# EAGLE schematic Safmet (EAGLE 9.6.2)

## Sheet 1 of 2
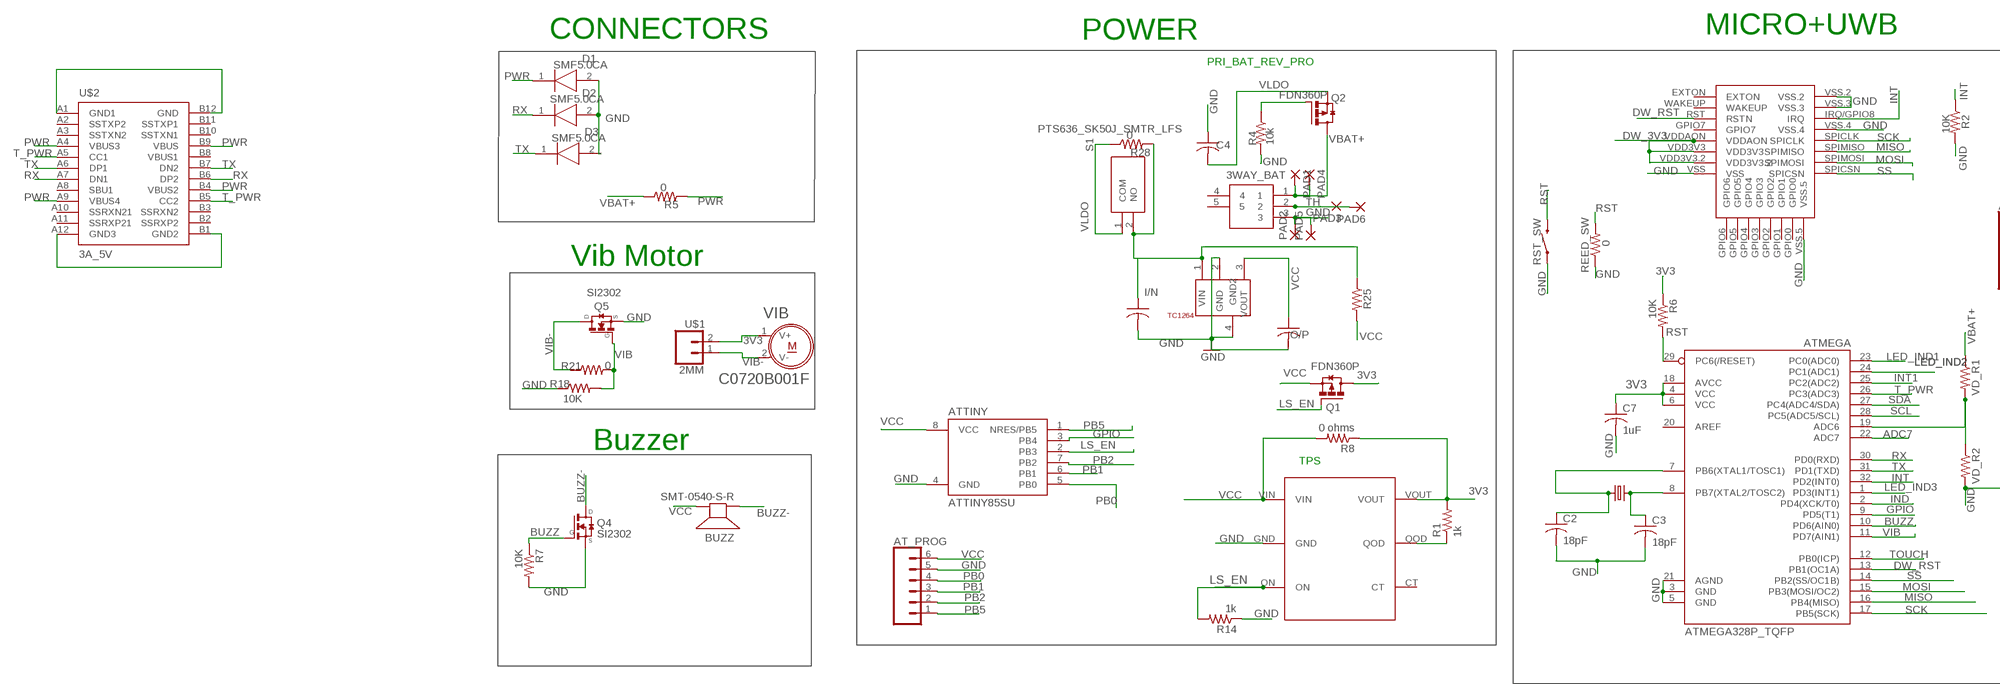
[diagram p0: schematic, sheet 1, part 1 of 2]
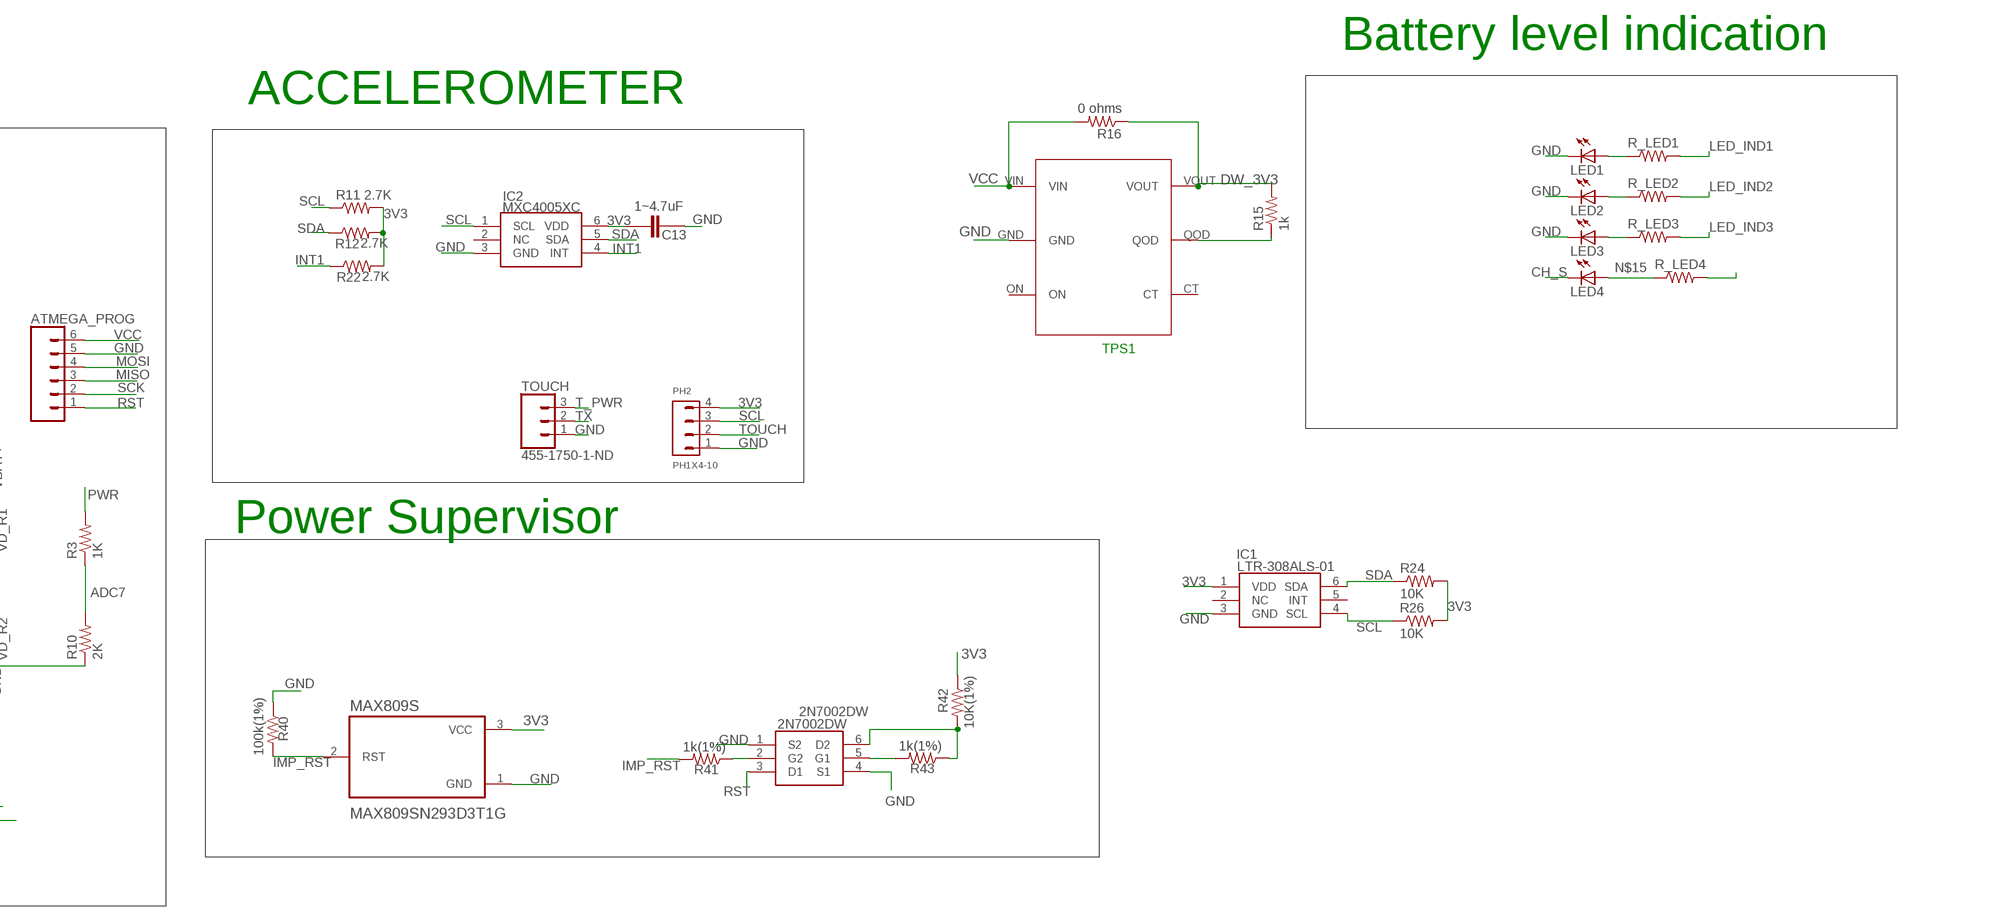
[diagram p1: schematic, sheet 1, part 2 of 2]

### Parts
2N7002DW  2N7002DW  [SOT65P210X110-6N]
3WAY_BAT  009155003541006  [009155003541006]
16MHZ  16MHz  CRYSTALTXC-7A  [CRYSTAL-TXC-7A]
AT_PROG  CONN_061.27MM  [1X06_1.27MM]
ATMEGA  ATMEGA328P_TQFP  [TQFP32-08]
ATMEGA_PROG  CONN_061.27MM  [1X06_1.27MM]
ATTINY  ATTINY85SU  [ATTINY85]
BUZZ  SMT-0540-S-R  [SMT-0540-S-R]
C2  18pF  C-US_CHIP-0402(1005-METRIC)  [CAPC1005X60]
C3  18pF  C-US_CHIP-0402(1005-METRIC)  [CAPC1005X60]
C4  4.7uF  C-US_CHIP-0402(1005-METRIC)  [CAPC1005X60]
C7  1uF  C-US_CHIP-0402(1005-METRIC)  [CAPC1005X60]
C13  1~4.7uF  C0402C201GAGACTU  [CAPC1005X55N]
D1  SMF5.0CA  [SODFL3618X108N]
D2  SMF5.0CA  [SODFL3618X108N]
D3  SMF5.0CA  [SODFL3618X108N]
DECAWAVE  DWM1000  [DWM1000]
I/N  1uF  C-US_CHIP-0402(1005-METRIC)  [CAPC1005X60]
IC1  LTR-308ALS-01  [LTR303ALS01]
IC2  MXC4005XC  [MXC4005XC]
LDO  TC1264  [SOT223]
LED1  LEDCHIPLED_0603  [CHIPLED_0603]
LED2  LEDCHIPLED_0603  [CHIPLED_0603]
LED3  LEDCHIPLED_0603  [CHIPLED_0603]
LED4  LEDCHIPLED_0603  [CHIPLED_0603]
MAX809S  MAX809SN293D3T1G  [SOT95P237X111-3N]
O/P  1uF 10V  C-US_CHIP-0402(1005-METRIC)  [CAPC1005X60]
PAD1  SMD2  [SMD1,27-2,54]
PAD2  SMD2  [SMD1,27-2,54]
PAD3  SMD2  [SMD1,27-2,54]
PAD4  SMD2  [SMD1,27-2,54]
PAD5  SMD2  [SMD1,27-2,54]
PAD6  SMD2  [SMD1,27-2,54]
PH2  PH1X4-10  [PH010-1-4]
Q1  FDN360P  [SUPER-SOT3]
Q2  FDN360P  [SUPER-SOT3]
Q4  SI2302  [SOT23]
Q5  SI2302  [SOT23]
R1  1k  R-US_R0402  [R0402]
R2  10K  R-US_R0402  [R0402]
R3  1K  R-US_R0402  [R0402]
R4  10k  R-US_R0402  [R0402]
R5  0  R-US_R0402  [R0402]
R6  10K  R-US_R0402  [R0402]
R7  10K  R-US_R0402  [R0402]
R8  0 ohms  R-US_R0402  [R0402]
R10  2K  R-US_R0402  [R0402]
R11  2.7K  R-US_R0402  [R0402]
R12  2.7K  R-US_R0402  [R0402]
R14  1k  R-US_R0402  [R0402]
R15  1k  R-US_R0402  [R0402]
R16  0 ohms  R-US_R0402  [R0402]
R18  10K  R-US_R0402  [R0402]
R21  0  R-US_R0402  [R0402]
R22  2.7K  R-US_R0402  [R0402]
R24  10K  R-US_R0402  [R0402]
R25  0ohm  R-US_R0402  [R0402]
R26  10K  R-US_R0402  [R0402]
R28  0  R-US_R0402  [R0402]
R40  100k(1%)  R-US_R0402  [R0402]
R41  1k(1%)  R-US_R0402  [R0402]
R42  10K(1%)  R-US_R0402  [R0402]
R43  1k(1%)  R-US_R0402  [R0402]
R_LED1  220  R-US_R0402  [R0402]
R_LED2  220  R-US_R0402  [R0402]
R_LED3  220  R-US_R0402  [R0402]
R_LED4  220  R-US_R0402  [R0402]
REED_SW  0  0_OHM_AXIAL-0.3_1/4W_5%  [AXIAL-0.3]
RST_SW  MOMENTARY-SWITCH-SPST-SMD-6.0X3.5MM  [TACTILE_SWITCH_SMD_6.0X3.5MM]
S1  PTS636_SK50J_SMTR_LFS  [PTS636SK50JSMTRLFS]
TOUCH  455-1750-1-ND  HACK_CONN_03  [1X03]
TPS  TPS22918  [SOT-23-6]
TPS1  TPS22918  [SOT-23-6]
U$1  2MM  [PHLS005-1-2]
U$2  3A_5V  USB-31C-F-24X7F  [CUI_USB-31C-F-24X7F]
VD_R1  12K  R-US_R0402  [R0402]
VD_R2  3.9K  R-US_R0402  [R0402]
VIB  C0720B001F  [XDCR_C0720B001F]

### Nets
3V3: ATMEGA.4(VCC) ATMEGA.6(VCC) ATMEGA.18(AVCC) C7.1 C13.1 IC1.1(VDD) IC2.6(VDD) MAX809S.3(VCC) PH2.4 Q1.3(D) R1.2 R6.1 R8.1 R11.2 R12.2 R22.2 R24.2 R26.2 R42.1 TPS.VOUT U$1.2 VIB.1(V+)
ADC7: ATMEGA.22(ADC7) R3.1 R10.2
BUZZ: ATMEGA.10(PD6(AIN0)) Q4.1(G) R7.1
BUZZ-: BUZZ.-(+) Q4.3(D)
CH_S: LED4.C ; also sheet 2
DW_3V3: DECAWAVE.VDD3V3 DECAWAVE.VDD3V3.2 DECAWAVE.VDDAON R15.2 R16.1 TPS1.VOUT
DW_RST: ATMEGA.13(PB1(OC1A)) DECAWAVE.RST(RSTN)
GND: 2N7002DW.1(S2) 2N7002DW.4(S1) 3WAY_BAT.3 AT_PROG.5 ATMEGA.3(GND) ATMEGA.5(GND) ATMEGA.21(AGND) ATMEGA_PROG.5 ATTINY.4(GND) C2.2 C3.2 C4.1 C7.2 C13.2 D1.2(A) D2.2(A) D3.2(A) DECAWAVE.VSS DECAWAVE.VSS.2 DECAWAVE.VSS.3 DECAWAVE.VSS.4 DECAWAVE.VSS.5 I/N.2 IC1.3(GND) IC2.3(GND) LDO.2(GND) LDO.4(GND2) LED1.C LED2.C LED3.C MAX809S.1(GND) O/P.2 PAD2.1(P) PAD5.1(P) PH2.1 Q4.2(S) Q5.2(S) R2.2 R4.2 R7.2 R10.1 R14.1 R18.1 R40.1 REED_SW.P$1 RST_SW.1 TOUCH.1 TPS1.GND TPS.GND VD_R2.2 ; also sheet 2
GPIO: ATMEGA.9(PD5(T1)) ATTINY.3(PB4)
IMP_RST: MAX809S.2(RST) R40.2 R41.2
IND: ATMEGA.2(PD4(XCK/T0)) ; also sheet 2
INT: ATMEGA.32(PD2(INT0)) DECAWAVE.IRQ/GPIO8(IRQ) R2.1
INT1: ATMEGA.25(PC2(ADC2)) IC2.4(INT) R22.1
LED_IND1: ATMEGA.23(PC0(ADC0)) R_LED1.2
LED_IND2: ATMEGA.24(PC1(ADC1)) R_LED2.2
LED_IND3: ATMEGA.1(PD3(INT1)) R_LED3.2
LS_EN: ATTINY.2(PB3) Q1.1(G) R14.2 TPS.ON
MISO: ATMEGA.16(PB4(MISO)) ATMEGA_PROG.3 DECAWAVE.SPIMISO
MOSI: ATMEGA.15(PB3(MOSI/OC2)) ATMEGA_PROG.4 DECAWAVE.SPIMOSI
N$1: R_LED4.2
N$2: 16MHZ.P$2 ATMEGA.8(PB7(XTAL2/TOSC2)) C3.1
N$3: 16MHZ.P$1 ATMEGA.7(PB6(XTAL1/TOSC1)) C2.1
N$4: 2N7002DW.2(G2) R41.1
N$5: R1.1 TPS.QOD
N$6: Q2.1(G) R4.1
N$7: LED1.A R_LED1.1
N$8: LED2.A R_LED2.1
N$9: I/N.1 LDO.1(VIN) R25.1 R28.2 S1.2(NO)
N$12: ATMEGA.19(ADC6) VD_R1.2 VD_R2.1
N$15: LED4.A R_LED4.1 ; also sheet 2
N$16: R15.1 TPS1.QOD
N$17: LED3.A R_LED3.1
N$18: U$2.A1(GND1) U$2.B12(GND)
N$19: U$2.A12(GND3) U$2.B1(GND2)
N$23: 2N7002DW.6(D2) R42.2 R43.1
N$24: 2N7002DW.5(G1) R43.2
PB0: AT_PROG.4 ATTINY.5(PB0)
PB1: AT_PROG.3 ATTINY.6(PB1)
PB2: AT_PROG.2 ATTINY.7(PB2)
PB5: AT_PROG.1 ATTINY.1(NRES/PB5)
PWR: D1.1(K) R3.2 R5.2 U$2.A4(VBUS3) U$2.A9(VBUS4) U$2.B4(VBUS2) U$2.B9(VBUS) ; also sheet 2
RST: 2N7002DW.3(D1) ATMEGA.29(PC6(/RESET)) ATMEGA_PROG.1 R6.2 REED_SW.P$2 RST_SW.2
RX: ATMEGA.30(PD0(RXD)) D2.1(K) U$2.A7(DN1) U$2.B6(DP2)
SCK: ATMEGA.17(PB5(SCK)) ATMEGA_PROG.2 DECAWAVE.SPICLK
SCL: ATMEGA.28(PC5(ADC5/SCL)) IC1.4(SCL) IC2.1(SCL) PH2.3 R11.1 R26.1
SDA: ATMEGA.27(PC4(ADC4/SDA)) IC1.6(SDA) IC2.5(SDA) R12.1 R24.1
SS: ATMEGA.14(PB2(SS/OC1B)) DECAWAVE.SPICSN
T_PWR: ATMEGA.26(PC3(ADC3)) TOUCH.3 U$2.A5(CC1) U$2.B5(CC2)
TH: 3WAY_BAT.2 PAD3.1(P) PAD6.1(P) ; also sheet 2
TOUCH: ATMEGA.12(PB0(ICP)) PH2.2
TX: ATMEGA.31(PD1(TXD)) D3.1(K) TOUCH.2 U$2.A6(DP1) U$2.B7(DN2)
VBAT+: 3WAY_BAT.1 PAD1.1(P) PAD4.1(P) Q2.3(D) R5.1 VD_R1.1 ; also sheet 2
VCC: AT_PROG.6 ATMEGA_PROG.6 ATTINY.8(VCC) BUZZ.+(-) LDO.3(VOUT) O/P.1 Q1.2(S) R8.2 R16.2 R25.2 TPS1.VIN TPS.VIN
VIB: ATMEGA.11(PD7(AIN1)) Q5.1(G) R18.2 R21.2
VIB-: Q5.3(D) R21.1 U$1.1 VIB.2(V-)
VLDO: C4.2 Q2.2(S) R28.1 S1.1(COM)
Unconnected: 3WAY_BAT.4 3WAY_BAT.5 ATMEGA.20(AREF) DECAWAVE.EXTON DECAWAVE.GPIO0 DECAWAVE.GPIO1 DECAWAVE.GPIO2 DECAWAVE.GPIO3 DECAWAVE.GPIO4 DECAWAVE.GPIO5 DECAWAVE.GPIO6 DECAWAVE.GPIO7 DECAWAVE.WAKEUP IC1.2(NC) IC1.5(INT) IC2.2(NC) TPS1.CT TPS1.ON TPS.CT U$2.A2(SSTXP2) U$2.A3(SSTXN2) U$2.A8(SBU1) U$2.A10(SSRXN21) U$2.A11(SSRXP21) U$2.B2(SSRXP2) U$2.B3(SSRXN2) U$2.B8(VBUS1) U$2.B10(SSTXN1) U$2.B11(SSTXP1)

### Notes on the sheet
- Battery level indication
- CONNECTORS | MICRO+UWB | ACCELEROMETER
- POWER
- PRI_BAT_REV_PRO
- TPS1
- Vib Motor
- Power Supervisor
- Buzzer
- TPS

## Sheet 2 of 2
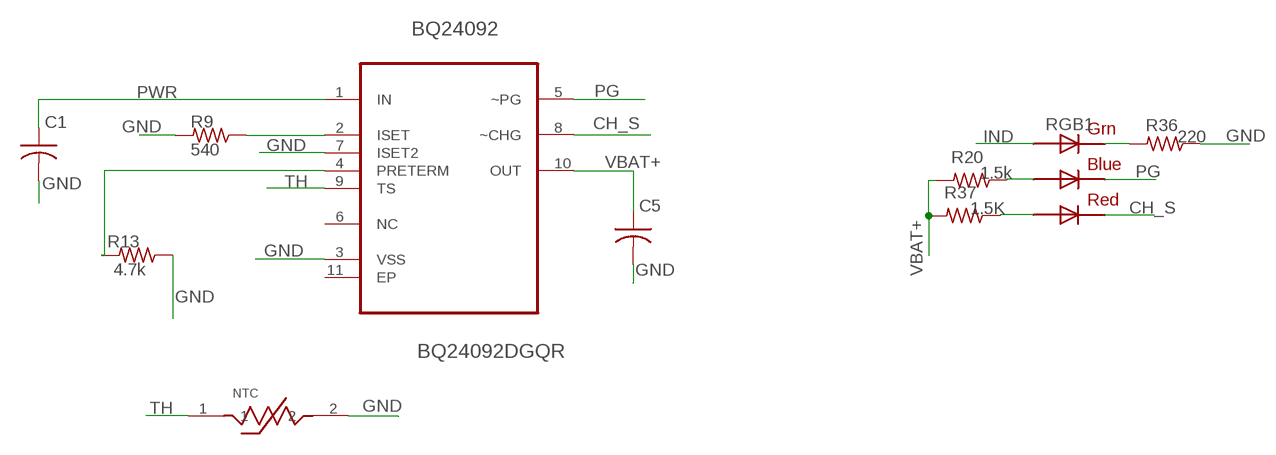
[diagram p2: schematic, sheet 2]

### Parts
BQ24092  BQ24092DGQR  [SOP50P490X110-11N]
C1  1uF  C-US_CHIP-0402(1005-METRIC)  [CAPC1005X60]
C5  1uF  C-US_CHIP-0402(1005-METRIC)  [CAPC1005X60]
NTC  NCP18WF104J03RB  [THERM_NCP18WF104J03RB]
R9  540  R-US_R0402  [R0402]
R13  4.7k  R-US_R0402  [R0402]
R20  1.5k  R-US_R0402  [R0402]
R36  220  R-US_R0402  [R0402]
R37  1.5K  R-US_R0402  [R0402]
RGB1  RGBLED5050  [RGBLED5050]

### Nets
CH_S: BQ24092.8(~CHG) RGB1.5(RED_C) ; also sheet 1
GND: BQ24092.3(VSS) BQ24092.7(ISET2) C1.2 C5.2 NTC.2 R9.2 R13.1 R36.1 ; also sheet 1
IND: RGB1.3(BLUE_A) ; also sheet 1
N$10: BQ24092.2(ISET) R9.1
N$11: BQ24092.4(PRETERM) R13.2
N$13: R36.2 RGB1.4(BLUE_C)
N$14: R20.1 RGB1.1(GREEN_A)
N$15: R37.1 RGB1.2(RED_A) ; also sheet 1
PG: BQ24092.5(~PG) RGB1.6(GREEN_C)
PWR: BQ24092.1(IN) C1.1 ; also sheet 1
TH: BQ24092.9(TS) NTC.1 ; also sheet 1
VBAT+: BQ24092.10(OUT) C5.1 R20.2 R37.2 ; also sheet 1
Unconnected: BQ24092.6(NC) BQ24092.11(EP)

## Library data of the parts
2N7002DW = 2N7002DW:2N7002DW: 2N7002DW, Dual N-channel MOSFET Transistor, 0.115A 60V, 6-Pin SC-70 Source: Datasheet; DESCRIPTION: 2N7002DW, Dual N-channel MOSFET Transistor, 0.115A 60V, 6-Pin SC-70; HEIGHT: 1.1mm; MANUFACTURER_NAME: ON Semiconductor; MANUFACTURER_PART_NUMBER: 2N7002DW; MOUSER_PART_NUMBER: 512-2N7002DW; MOUSER_PRICE-STOCK: https://www.mouser.co.uk/ProductDetail/ON-Semiconductor/2N7002DW?qs=4aVxpR%2FL9VItb3yGt5CeZg%3D%3D
3WAY_BAT = 009155003541006:009155003541006: Battery Contacts 3 Way .4um Gold RT Angle 2.5mm Source: Datasheet <https://componentsearchengine.com/Datasheets/1/009155003541006.pdf>; DESCRIPTION: Battery Contacts 3 Way .4um Gold RT Angle 2.5mm; HEIGHT: 4mm; MANUFACTURER_NAME: AVX; MANUFACTURER_PART_NUMBER: 009155003541006; MOUSER_PART_NUMBER: 581-009155003541006; MOUSER_PRICE-STOCK: https://www.mouser.com/Search/Refine.aspx?Keyword=581-009155003541006
16MHZ = SparkFun-FreqCtrl:CRYSTAL: Various standard crystals. Proven footprints.
AT_PROG ATMEGA_PROG = SparkFun-Connectors:CONN_06: Multi connection point. Often used as Generic Header-pin footprint for 0.1 inch spaced/style header connections On any of the 0.1 inch spaced packages, you can populate with these: Break Away Headers - Straight <https://www.sparkfun.com/products/116> (PRT-00116) Break Away Male Headers - Right Angle <https://www.sparkfun.com/products/553> (PRT-00553) Female Headers <https://www.sparkfun.com/products/115> (PRT-00115) Break Away Headers - Machine Pin <https://www.sparkfun.com/products/117> (PRT-00117) Break Away Female Headers - Swiss Machine Pin <https://www.sparkfun.com/products/743> (PRT-00743) Arduino Stackable Header - 6 Pin <https://www.sparkfun.com/products/9280> (PRT-09280) For SCREWTERMINALS and SPRING TERMINALS visit here: Screw Terimnals on SparkFun.com <https://www.sparkfun.com/search/results?term=Screw+Terminals> (5mm/3.5mm/2.54mm spacing) This device is also useful as a general connection point to wire up your design to another part of your project. Our various solder wires solder well into these plated through hole pads. Hook-Up Wire - Assortment (Stranded, 22 AWG) <https://www.sparkfun.com/products/11375> (PRT-11375) Hook-Up Wire - Assortment (Solid Core, 22 AWG) <https://www.sparkfun.com/products/11367> (PRT-11367) View the entire wire category on our website here <https://www.sparkfun.com/categories/141>
ATMEGA = SparkFun-DigitalIC:ATMEGA328P_TQFP; PROD_ID: IC-09069
ATTINY = attiny85:ATTINY85: ATMEL ATtiny 85
BQ24092 = BQ24092DGQR:BQ24092DGQR: 1A, Single-Input, Single Cell Li-Ion Battery Charger; AVAILABILITY: Unavailable; DESCRIPTION: 1A, Single-Input, Single-Cell Li-Ion Battery Charger with Operation Over JEITA and 10kO NTC 10-MSOP-PowerPAD -40 to 150; MF: Texas Instruments; MP: BQ24092DGQR; PACKAGE: MSOP-10 Texas Instruments; PRICE: None
BUZZ = adafruit:SMT-0540-S-R: SMT-0549-S-R Small surface-mount magnetic buzzer
C1-C5 C7 I/N O/P = Capacitor:C-US: Capacitor - ANSI; CATEGORY: Capacitor
C13 = C0402C201GAGACTU:C0402C201GAGACTU; AVAILABILITY: Unavailable; DESCRIPTION: Multilayer Ceramic Capacitors MLCC - SMD/SMT 250V 200pF C0G 0402 0.02; MF: KEMET; MP: C0402C201GAGACTU; PACKAGE: 0402 KEMET; PRICE: None
D1-D3 = SMF5.0CA:SMF5.0CA: ESD Suppressors / TVS Diodes "TVS SMF 5.0V BI, 7'' TR" Surface Mount 200W > SMF Series Source: Datasheet <https://www.mouser.de/datasheet/2/240/Littelfuse_TVS_Diode_SMF_Datasheet.pdf-1698977.pdf>; DESCRIPTION: ESD Suppressors / TVS Diodes "TVS SMF 5.0V BI, 7'' TR" Surface Mount 200W > SMF Series; HEIGHT: 1.08mm; MANUFACTURER_NAME: LITTELFUSE; MANUFACTURER_PART_NUMBER: SMF5.0CA; MOUSER_PART_NUMBER: 576-SMF5.0CA; MOUSER_PRICE-STOCK: https://www.mouser.co.uk/ProductDetail/Littelfuse/SMF50CA?qs=d0WKAl%252BL4KbRT8gYdmqI%252Bg%3D%3D
DECAWAVE = DWM1000:DWM1000
IC1 = LTR-308ALS-01:LTR-308ALS-01: Ambient Light Sensors Ambient Light Photo Sensor Source: Datasheet <https://optoelectronics.liteon.com/upload/download/DS86-2016-0027/LTR-308ALS_Final_ DS_V1 1.pdf>; DESCRIPTION: Ambient Light Sensors Ambient Light Photo Sensor; HEIGHT: 0mm; MANUFACTURER_NAME: Lite-On; MANUFACTURER_PART_NUMBER: LTR-308ALS-01; MOUSER_PART_NUMBER: N/A; MOUSER_PRICE-STOCK: https://www.mouser.com/Search/Refine.aspx?Keyword=N%2FA
IC2 = MXC4005XC_ACC:MXC4005XC: Accelerometers Monolithic and Wafer Level Packaged Three-Axis Accelerometer Source: Datasheet <http://www.memsic.cn/userfiles/files/Datasheets/Accelerometer-Datasheets/MXC400xXC_Rev_B.pdf>; DESCRIPTION: Accelerometers Monolithic and Wafer Level Packaged Three-Axis Accelerometer; HEIGHT: 0.885mm; MANUFACTURER_NAME: MEMSIC; MANUFACTURER_PART_NUMBER: MXC4005XC; MOUSER_PART_NUMBER: 438-MXC4005XC; MOUSER_PRICE-STOCK: https://www.mouser.co.uk/ProductDetail/MEMSIC/MXC4005XC?qs=RcG8xmE7yp3iyYgWLmAtUw%3D%3D
LDO = tc1264:TC1264
LED1-LED4 = adafruit:LED: LED OSRAM: - CHIPLED LG R971, LG N971, LY N971, LG Q971, LY Q971, LO R971, LY R971 LH N974, LH R974 LS Q976, LO Q976, LY Q976 LO Q996 - Hyper CHIPLED LW Q18S LB Q993, LB Q99A, LB R99A - SideLED LS A670, LO A670, LY A670, LG A670, LP A670 LB A673, LV A673, LT A673, LW A673 LH A674 LY A675 LS A676, LA A676, LO A676, LY A676, LW A676 LS A679, LY A679, LG A679 - Hyper Micro SIDELED® LS Y876, LA Y876, LO Y876, LY Y876 LT Y87S - SmartLED LW L88C, LW L88S LB L89C, LB L89S, LG L890 LS L89K, LO L89K, LY L89K LS L896, LA L896, LO L896, LY L896 - TOPLED LS T670, LO T670, LY T670, LG T670, LP T670 LSG T670, LSP T670, LSY T670, LOP T670, LYG T670 LG T671, LOG T671, LSG T671 LB T673, LV T673, LT T673, LW T673 LH T674 LS T676, LA T676, LO T676, LY T676, LB T676, LH T676, LSB T676, LW T676 LB T67C, LV T67C, LT T67C, LS T67K, LO T67K, LY T67K, LW E67C LS E67B, LA E67B, LO E67B, LY E67B, LB E67C, LV E67C, LT E67C LW T67C LS T679, LY T679, LG T679 LS T770, LO T770, LY T770, LG T770, LP T770 LB T773, LV T773, LT T773, LW T773 LH T774 LS E675, LA E675, LY E675, LS T675 LS T776, LA T776, LO T776, LY T776, LB T776 LHGB T686 LT T68C, LB T68C - Hyper Mini TOPLED® LB M676 - Mini TOPLED Santana® LG M470 LS M47K, LO M47K, LY M47K Source: http://www.osram.convergy.de/
MAX809S = MAX809SN293D3T1G:MAX809SN293D3T1G: None Check prices <https://pricing.snapeda.com/search/part/MAX809SN293D3T1G/?ref=eda>; AVAILABILITY: Warning; DESCRIPTION: Supervisor Push-Pull, Totem Pole 1 Channel SOT-23-3 (TO-236); MF: ON Semiconductor; MP: MAX809SN293D3T1G; PACKAGE: SOT-23-3 ON Semiconductor; PRICE: None; PURCHASE-URL: https://pricing.snapeda.com/search/part/MAX809SN293D3T1G/?ref=eda
NTC = NCP18WF104J03RB:NCP18WF104J03RB: Thermistor NTC 100K Ohm 5% 2-Pin 0603 Surface Mount Solder Pad 4311K T/R; AVAILABILITY: Unavailable; DESCRIPTION: NTC Thermistor 100k 0603 _1608 Metric_; MF: Murata Electronics; MP: NCP18WF104J03RB; PACKAGE: 0603 Murata Electronics; PRICE: None
PAD1-PAD6 = wirepad:SMD2: SMD PAD
PH2 = pel_hdr:PH1X4
Q1 Q2 = FDN360P:FDN360P: Single P-Channel, PowerTrench (R) MOSFET Source: http://www.fairchildsemi.com/ds/FD/FDN360P.pdf Check prices <https://snapeda.com/parts/FDN360P/ON%20Semiconductor/view-part/?ref=eda>; ARROW_ELECTRONICS-PURCHASE-URL: https://snapeda.com/shop?store=Arrow+Electronics&id=2105995; AVAILABILITY: Good; DESCRIPTION: P-Channel 30V 2A (Ta) 500mW (Ta) Surface Mount SuperSOT-3; DIGIKEY-PURCHASE-URL: https://snapeda.com/shop?store=DigiKey&id=2105995; MF: ON Semiconductor; MOUSER-PURCHASE-URL: https://snapeda.com/shop?store=Mouser&id=2105995; MP: FDN360P; PACKAGE: SC-59 ON Semiconductor; PRICE: None
Q4 Q5 = SI2302:SI2302: MOSFET N-Channel 20 V (D-S) Buy Part <https://snapeda.com/parts/SI2302/Vishay%20Siliconix/view-part/?ref=eda>; AVAILABILITY: Bad; DESCRIPTION: N-Channel 20V 2.6A (Ta) 710mW (Ta) Surface Mount SOT-23-3 (TO-236); MF: Vishay Siliconix; MP: SI2302; PACKAGE: SOT-23-3 Vishay Siliconix; PRICE: None
R1-R16 R18 R20-R22 R24-R26 R28 R36 R37 R40-R43 R_LED1-R_LED4 VD_R1 VD_R2 = resistor2:R-US_: RESISTOR, American symbol
REED_SW = Hacklab_Resistors:0_OHM: Generic Resistor Package A resistor is a passive two-terminal electrical component that implements electrical resistance as a circuit element. Resistors act to reduce current flow, and, at the same time, act to lower voltage levels within circuits. - Wikipedia; PART_NO: 0_OHM_AXIAL-0.3_1/4W_5%; PINS: 2; SKU: RES_0_OHM_AXIAL-0.3 _1/4W_5%; TYPE: TH
RGB1 = adafruit:RGBLED: For 5050 RGB LEDs, the order of the LEDs may vary from one manufacturer to another!
RST_SW = SparkFun-Switches:MOMENTARY-SWITCH-SPST: Momentary Switch (Pushbutton) - SPST Normally-open (NO) SPST momentary switches (buttons, pushbuttons). Variants PTH-12MM - 12mm square, through-hole Momentary Pushbutton Switch - 12mm Square <https://www.sparkfun.com/products/9190> (COM-09190) PTH-6.0MM, PTH-6.0MM-KIT - 6.0mm square, through-hole Mini Pushbutton Switch <https://www.sparkfun.com/products/97> (COM-00097) KIT package intended for soldering kit's - only one side of pads' copper is exposed. PTH-RIGHT-ANGLE-KIT - Right-angle, through-hole Right Angle Tactile Button <https://www.sparkfun.com/products/10791> - Used on SparkFun BigTime Watch Kit <https://www.sparkfun.com/products/11734> SMD-12MM - 12mm square, surface-mount Tactile Button - SMD (12mm) <https://www.sparkfun.com/products/12993> (COM-12993) Used on SparkFun PicoBoard <https://www.sparkfun.com/products/11888> SMD-4.5MM - 4.5mm Square Trackball Switch Used on SparkFun Blackberry Trackballer Breakout <https://www.sparkfun.com/products/13169> SMD-4.6MMX2.8MM - 4.60mm x 2.80mm, surface mount Used on SparkFun SAMD21 Mini Breakout <https://www.sparkfun.com/products/13664> SMD-5.2MM, SMD-5.2-REDUNDANT - 5.2mm square, surface-mount Mini Pushbutton Switch - SMD <https://www.sparkfun.com/products/8720> (COM-08720) Used on Arduino Pro Mini <https://www.sparkfun.com/products/11114> REDUNDANT package connects both switch circuits together SMD-6.0X3.5MM - 6.0 x 3.5mm, surface mount Momentary Reset Switch SMD <https://www.sparkfun.com/products/8229> (COM-08229) SMD-6.2MM-TALL - 6.2mm square, surface mount Tactile Button - SMD (6mm) <https://www.sparkfun.com/products/12992> Used on SparkFun Digital Sandbox <https://www.sparkfun.com/products/12651> SMD-RIGHT-ANGLE - Right-angle, surface mount Used on SparkFun Block for Intel® Edison - Arduino <https://www.sparkfun.com/products/13036>; PROD_ID: SWCH-00815; SF_SKU: COM-08229
S1 = 6x3.5mm_5mm_H switch:PTS636_SK50J_SMTR_LFS: Tactile Switches Tact 50mA 12VDC, 6.0x3.5, 5.0mm H, 250gf, J leads, No ground pin, Red Actuator Source: Datasheet <https://dznh3ojzb2azq.cloudfront.net/products/Tactile/PTS636/documents/datasheet.pdf>; DESCRIPTION: Tactile Switches Tact 50mA 12VDC, 6.0x3.5, 5.0mm H, 250gf, J leads, No ground pin, Red Actuator; HEIGHT: 5mm; MANUFACTURER_NAME: C & K COMPONENTS; MANUFACTURER_PART_NUMBER: PTS636 SK50J SMTR LFS; MOUSER_PART_NUMBER: 611-PTS636SK50JSMTRL; MOUSER_PRICE-STOCK: https://www.mouser.co.uk/ProductDetail/CK/PTS636-SK50J-SMTR-LFS?qs=vLWxofP3U2y%2F9cEgatLecw%3D%3D
TOUCH = Hacklab_Connectors:HACK_CONN_03: Multi connection point. Often used as Generic Header-pin footprint for 0.1 inch spaced/style header connections; PROD_ID: XXX-00000
TPS TPS1 = tps22918:TPS22918
U$1 = 2MM:2MM
U$2 = Hack_USB-31C-F-24x7F:USB-31C-F-24X7F; MFR: XIAMEN; PART_NO: USB-31C-F-24x7F; PINS: 24; SKU: USB-31C-F-24x7F; TYPE: SMD
VIB = C0720B001F:C0720B001F: Vibration Motor Coin 3v Flex Check prices <https://snapeda.com/parts/C0720B001F/Jinlong%20Machinery/view-part/?ref=eda>; AVAILABILITY: Warning; DESCRIPTION: DC Motor Vibration, ERM 10000 RPM 3VDC; DIGIKEY-PURCHASE-URL: https://snapeda.com/shop?store=DigiKey&id=645169; MF: Jinlong Machinery; MP: C0720B001F; PACKAGE: Jinlong Machinery; PRICE: None